# Altium project STM32F103_oled_demo.PrjPcb
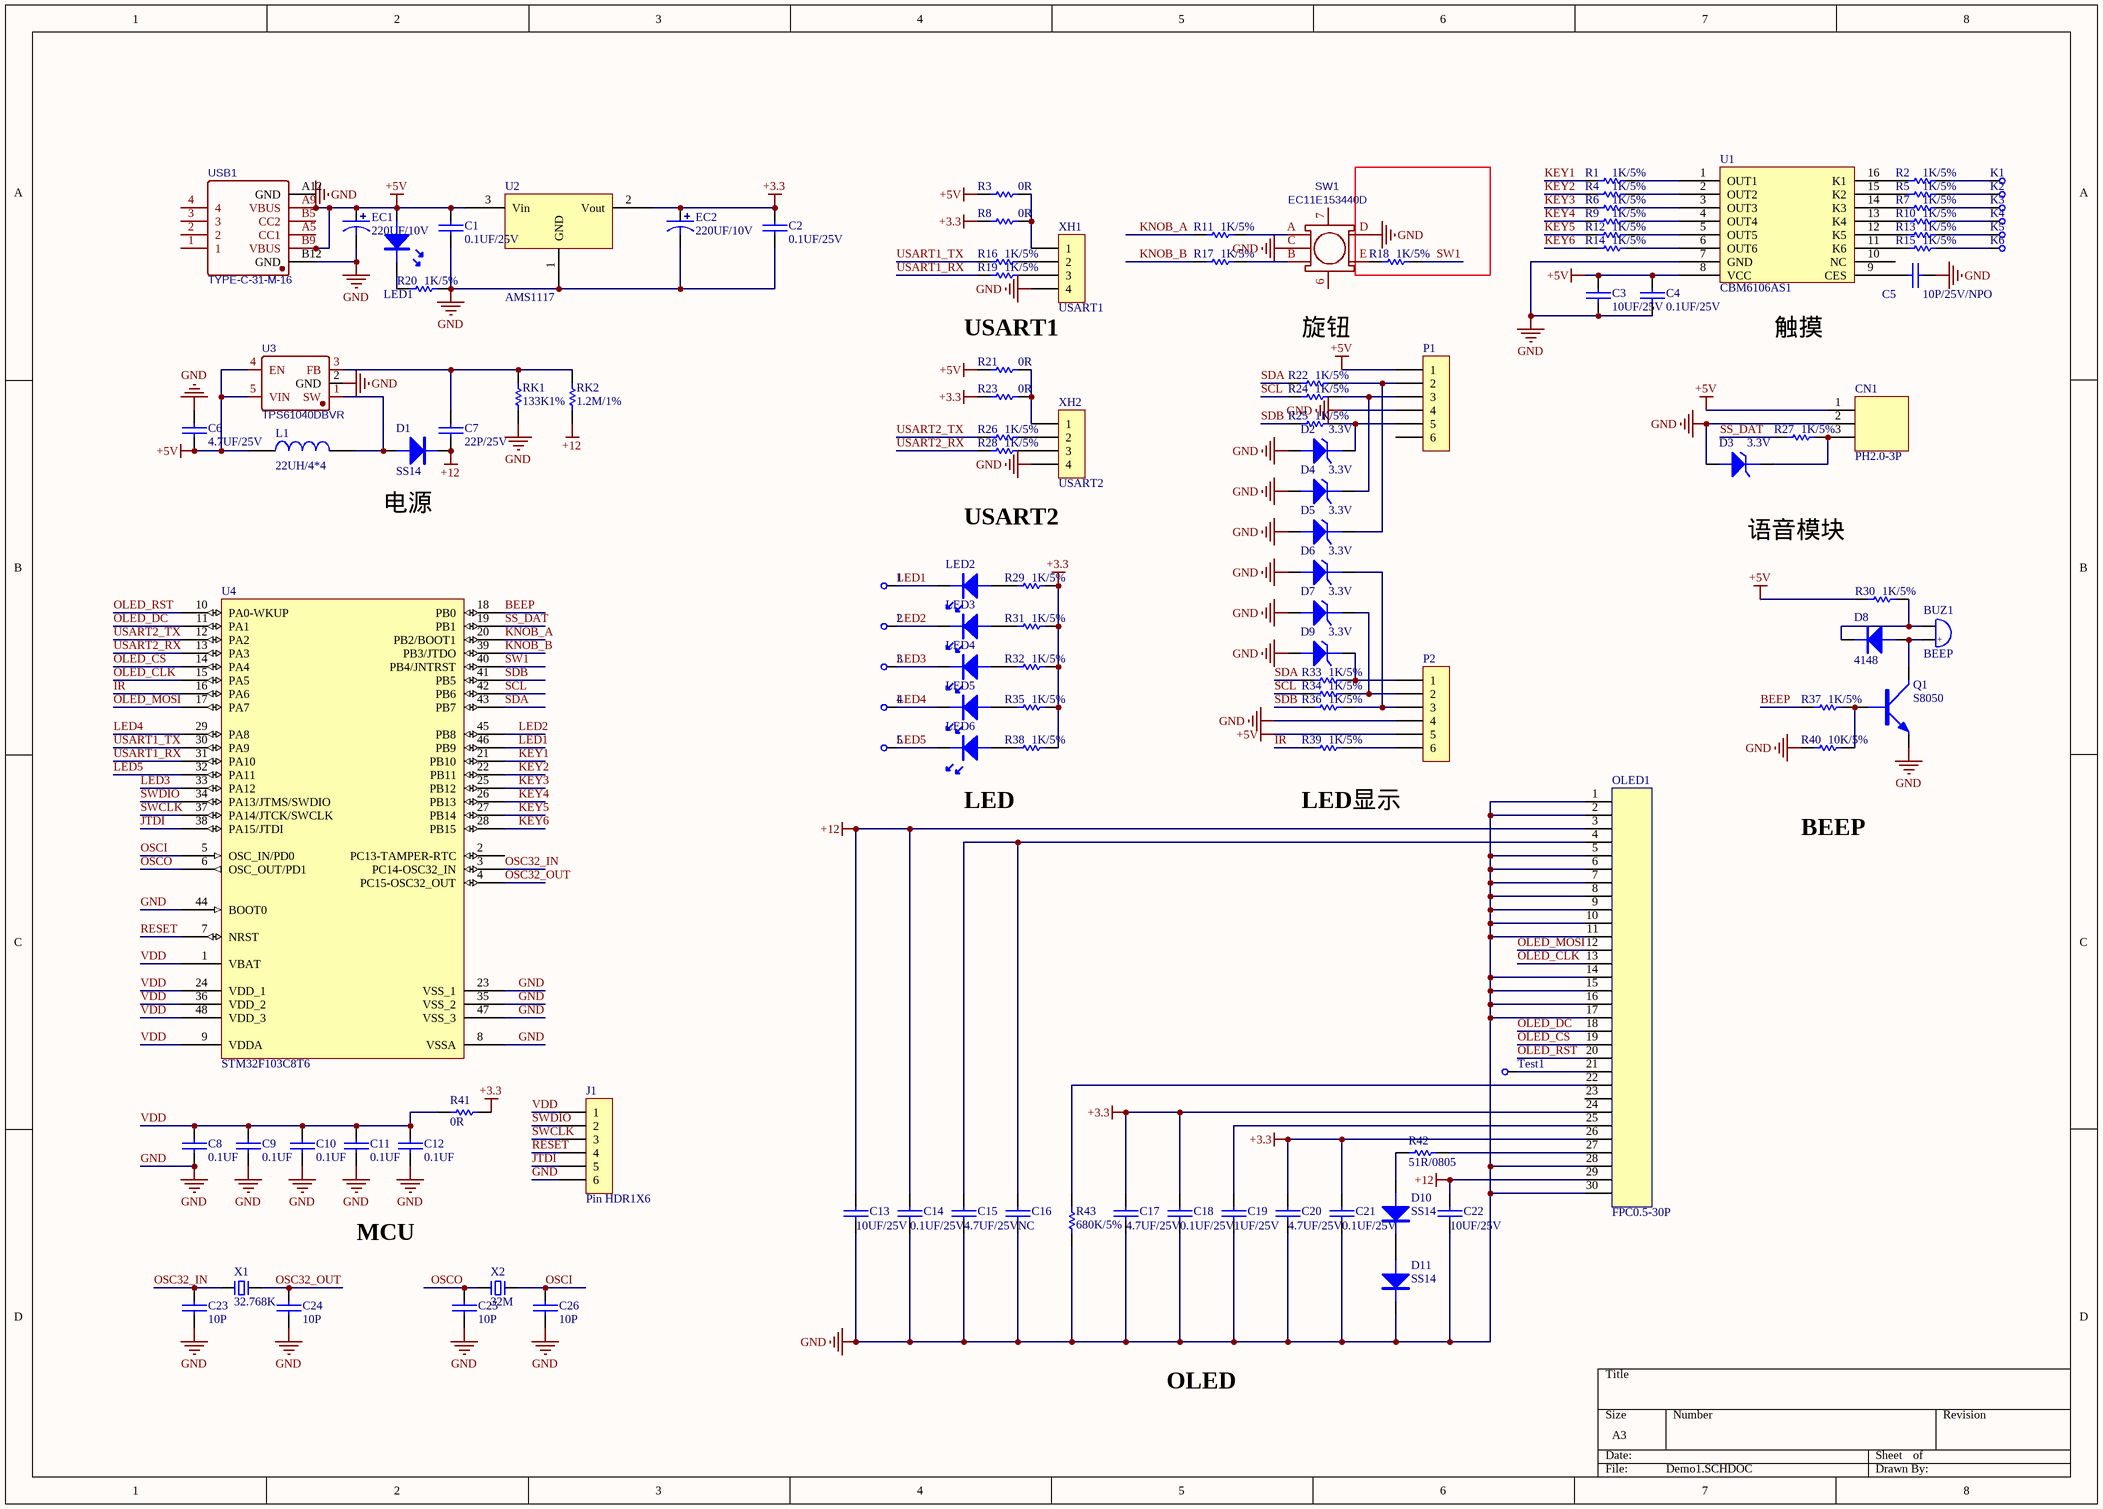
[diagram p0: Demo1.SCHDOC]
1 sheet, 120 parts. Net scope: global (net labels, ports and power ports of the same name join across sheets).
Board file: Demo1.PcbDoc

## Sheet Demo1.SCHDOC
size A3

### Parts
1  CHECK  [CHECK-A]  (value not drawn)
2  CHECK  [CHECK-A]  (value not drawn)
3  CHECK  [CHECK-A]  (value not drawn)
4  CHECK  [CHECK-A]  (value not drawn)
5  CHECK  [CHECK-A]  (value not drawn)
BUZ1  BEEP  [BEEP 6.5x12x6]
C1  0.1UF/25V  [0603C]
C2  0.1UF/25V  [0603C]
C3  10UF/25V  [0603C]
C4  0.1UF/25V  [0603C]
C5  10P/25V/NPO  [0603C]
C6  4.7UF/25V  [0603C]
C7  22P/25V  [0603C]
C8  0.1UF  [0603C]
C9  0.1UF  [0603C]
C10  0.1UF  [0603C]
C11  0.1UF  [0603C]
C12  0.1UF  [0603C]
C13  10UF/25V  [0603C]
C14  0.1UF/25V  [0603C]
C15  4.7UF/25V  [0603C]
C16  NC  [0603C]
C17  4.7UF/25V  [0603C]
C18  0.1UF/25V  [0603C]
C19  1UF/25V  [0603C]
C20  4.7UF/25V  [0603C]
C21  0.1UF/25V  [0603C]
C22  10UF/25V  [0603C]
C23  10P  [0603C]
C24  10P  [0603C]
C25  10P  [0603C]
C26  10P  [0603C]
CN1  PH2.0-3P  [PH2.0-3P]
D1  SS14  [SMA/DO-214AC]
D2  3.3V  [SOD-123]
D3  3.3V  [SOD-123]
D4  3.3V  [SOD-123]
D5  3.3V  [SOD-123]
D6  3.3V  [SOD-123]
D7  3.3V  [SOD-123]
D8  4148  [SOD-123]
D9  3.3V  [SOD-123]
D10  SS14  [SMA/DO-214AC]
D11  SS14  [SMA/DO-214AC]
EC1  220UF/10V  [SMD-EC6.3X6.3X10]
EC2  220UF/10V  [SMD-EC6.3X6.3X10]
J1  Pin HDR1X6  [Pin HDR1X6/2.54mm-S]
K1  CHECK  [CHECK-A]  (value not drawn)
K2  CHECK  [CHECK-A]  (value not drawn)
K3  CHECK  [CHECK-A]  (value not drawn)
K4  CHECK  [CHECK-A]  (value not drawn)
K5  CHECK  [CHECK-A]  (value not drawn)
K6  CHECK  [CHECK-A]  (value not drawn)
L1  22UH/4*4  [CD42]
LED1  (no value)  [LED-0603W]
LED2  (no value)  [LED-0603W]
LED3  (no value)  [LED-0603W]
LED4  (no value)  [LED-0603W]
LED5  (no value)  [LED-0603W]
LED6  (no value)  [LED-0603W]
OLED1  FPC0.5-30P  [FPC0.5-30P]
P1  (no value)  [Pin HDR1X6/2.54mm-S]
P2  (no value)  [Pin HDR1X6/2.54mm-S]
Q1  S8050  [SOT-23]
R1  1K/5%  [0603R]
R2  1K/5%  [0603R]
R3  0R  [0603R]
R4  1K/5%  [0603R]
R5  1K/5%  [0603R]
R6  1K/5%  [0603R]
R7  1K/5%  [0603R]
R8  0R  [0603R]
R9  1K/5%  [0603R]
R10  1K/5%  [0603R]
R11  1K/5%  [0603R]
R12  1K/5%  [0603R]
R13  1K/5%  [0603R]
R14  1K/5%  [0603R]
R15  1K/5%  [0603R]
R16  1K/5%  [0603R]
R17  1K/5%  [0603R]
R18  1K/5%  [0603R]
R19  1K/5%  [0603R]
R20  1K/5%  [0603R]
R21  0R  [0603R]
R22  1K/5%  [0603R]
R23  0R  [0603R]
R24  1K/5%  [0603R]
R25  1K/5%  [0603R]
R26  1K/5%  [0603R]
R27  1K/5%  [0603R]
R28  1K/5%  [0603R]
R29  1K/5%  [0603R]
R30  1K/5%  [0603R]
R31  1K/5%  [0603R]
R32  1K/5%  [0603R]
R33  1K/5%  [0603R]
R34  1K/5%  [0603R]
R35  1K/5%  [0603R]
R36  1K/5%  [0603R]
R37  1K/5%  [0603R]
R38  1K/5%  [0603R]
R39  1K/5%  [0603R]
R40  10K/5%  [0603R]
R41  0R  [0603R]
R42  51R/0805  [0805R]
R43  680K/5%  [0603R]
RK1  133K1%  [0603R]
RK2  1.2M/1%  [0603R]
SW1  EC11E153440D  [SW-TH_EC11XXXXXXXX]
Test1  CHECK  [CHECK-A]  (value not drawn)
U1  CBM6106AS1  [SOP16]
U2  AMS1117  [SOT223]
U3  TPS61040DBVR  [SOT-23-5_L3.0-W1.7-P0.95-LS2.8-BR]
U4  STM32F103C8T6  [LQFP48 7X7]
USB1  TYPE-C-31-M-16  [TYPE-C-SMD_TYPE-C-31-M-16]
X1  32.768K  [OSC 3215-2P]
X2  32M  [OSC HC-49SMD]
XH1  USART1  [XH4/2.54mm/180]
XH2  USART2  [XH4/2.54mm/180]

### Nets
+3.3: C2.2 C17.2 C18.2 C20.2 C21.2 EC2.1 OLED1.24 OLED1.26 R8.1 R23.1 R29.1 R31.1 R32.1 R35.1 R38.1 R41.2 U2.2(Vout)
+5V: C1.2 C3.2 C4.2 C6.1 CN1.1 EC1.1 L1.1 LED1.A P1.1 P2.5 R3.1 R21.1 R30.2 U1.8(VCC) U2.3(Vin) U3.4(EN) U3.5(VIN) USB1.A9(VBUS) USB1.B9(VBUS)
+12: C7.1 C13.2 C14.2 C22.2 D1.K OLED1.3 OLED1.29 RK2.1
GND: C1.1 C2.1 C3.1 C4.1 C5.1 C6.2 C8.1 C9.1 C10.1 C11.1 C12.1 C13.1 C14.1 C15.1 C16.1 C17.1 C18.1 C19.1 C20.1 C21.1 C22.1 C23.1 C24.1 C25.1 C26.1 CN1.2 D2.A D3.A D4.A D5.A D6.A D7.A D9.A D11.K EC1.2 EC2.2 J1.6 OLED1.1 OLED1.2 OLED1.5 OLED1.6 OLED1.7 OLED1.8 OLED1.9 OLED1.10 OLED1.11 OLED1.14 OLED1.15 OLED1.16 OLED1.17 OLED1.28 OLED1.30 P1.4 P2.4 Q1.E R20.1 R40.2 R43.1 RK1.1 SW1.C SW1.D U1.7(GND) U2.1(GND) U3.2(GND) U4.8(VSSA) U4.23(VSS_1) U4.35(VSS_2) U4.44(BOOT0) U4.47(VSS_3) USB1.B12(GND) XH1.4 XH2.4
BEEP: R37.2 U4.18(PB0)
IR: R39.2 U4.16(PA6)
JTDI: J1.5 U4.38(PA15/JTDI)
KEY1: R1.2 U4.21(PB10)
KEY2: R4.2 U4.22(PB11)
KEY3: R6.2 U4.25(PB12)
KEY4: R9.2 U4.26(PB13)
KEY5: R12.2 U4.27(PB14)
KEY6: R14.2 U4.28(PB15)
KNOB_A: R11.2 U4.20(PB2/BOOT1)
KNOB_B: R17.2 U4.39(PB3/JTDO)
LED1: 1.1 LED2.K U4.46(PB9)
LED2: 2.1 LED3.K U4.45(PB8)
LED3: 3.1 LED4.K U4.33(PA12)
LED4: 4.1 LED5.K U4.29(PA8)
LED5: 5.1 LED6.K U4.32(PA11)
OLED_CLK: OLED1.13 U4.15(PA5)
OLED_CS: OLED1.19 U4.14(PA4)
OLED_DC: OLED1.18 U4.11(PA1)
OLED_MOSI: OLED1.12 U4.17(PA7)
OLED_RST: OLED1.20 U4.10(PA0-WKUP)
OSC32_IN: C23.2 U4.3(PC14-OSC32_IN) X1.1
OSC32_OUT: C24.2 U4.4(PC15-OSC32_OUT) X1.2
OSCI: C26.2 U4.5(OSC_IN/PD0) X2.2
OSCO: C25.2 U4.6(OSC_OUT/PD1) X2.1
RESET: J1.4 U4.7(NRST)
SCL: R24.2 R34.2 U4.42(PB6)
SDA: R22.2 R33.2 U4.43(PB7)
SDB: R25.2 R36.2 U4.41(PB5)
SS_DAT: R27.2 U4.19(PB1)
SW1: R18.1 U4.40(PB4/JNTRST)
SWCLK: J1.3 U4.37(PA14/JTCK/SWCLK)
SWDIO: J1.2 U4.34(PA13/JTMS/SWDIO)
USART1_RX: R19.2 U4.31(PA10)
USART1_TX: R16.2 U4.30(PA9)
USART2_RX: R28.2 U4.13(PA3)
USART2_TX: R26.2 U4.12(PA2)
VDD: C8.2 C9.2 C10.2 C11.2 C12.2 J1.1 R41.1 U4.1(VBAT) U4.9(VDDA) U4.24(VDD_1) U4.36(VDD_2) U4.48(VDD_3)
NetBUZ1_1: BUZ1.1 D8.A Q1.C
NetBUZ1_2: BUZ1.2 D8.K R30.1
NetC5_2: C5.2 U1.9(CES)
NetC7_2: C7.2 RK1.2 RK2.2 U3.3(FB)
NetC15_2: C15.2 C16.2 OLED1.4
NetC19_2: C19.2 OLED1.25
NetCN1_3: CN1.3 D3.K R27.1
NetD1_A: D1.A L1.2 U3.1(SW)
NetD2_K: D2.K P1.5 R25.1
NetD4_K: D4.K P1.3 R24.1
NetD5_K: D5.K P1.2 R22.1
NetD6_K: D6.K P2.3 R36.1
NetD7_K: D7.K P2.2 R34.1
NetD9_K: D9.K P2.1 R33.1
NetD10_A: D10.A R42.1
NetD10_K: D10.K D11.A
NetK1_1: K1.1 R2.1
NetK2_1: K2.1 R5.1
NetK3_1: K3.1 R7.1
NetK4_1: K4.1 R10.1
NetK5_1: K5.1 R13.1
NetK6_1: K6.1 R15.1
NetLED1_K: LED1.K R20.2
NetLED2_A: LED2.A R29.2
NetLED3_A: LED3.A R31.2
NetLED4_A: LED4.A R32.2
NetLED5_A: LED5.A R35.2
NetLED6_A: LED6.A R38.2
NetOLED1_21: OLED1.21 Test1.1
NetOLED1_22: OLED1.22 R43.2
NetOLED1_27: OLED1.27 R42.2
NetP2_6: P2.6 R39.1
NetQ1_B: Q1.B R37.1 R40.1
NetR1_1: R1.1 U1.1(OUT1)
NetR2_2: R2.2 U1.16(K1)
NetR3_2: R3.2 R8.2 XH1.1
NetR4_1: R4.1 U1.2(OUT2)
NetR5_2: R5.2 U1.15(K2)
NetR6_1: R6.1 U1.3(OUT3)
NetR7_2: R7.2 U1.14(K3)
NetR9_1: R9.1 U1.4(OUT4)
NetR10_2: R10.2 U1.13(K4)
NetR11_1: R11.1 SW1.A
NetR12_1: R12.1 U1.5(OUT5)
NetR13_2: R13.2 U1.12(K5)
NetR14_1: R14.1 U1.6(OUT6)
NetR15_2: R15.2 U1.11(K6)
NetR16_1: R16.1 XH1.2
NetR17_1: R17.1 SW1.B
NetR18_2: R18.2 SW1.E
NetR19_1: R19.1 XH1.3
NetR21_2: R21.2 R23.2 XH2.1
NetR26_1: R26.1 XH2.2
NetR28_1: R28.1 XH2.3

Not connected (* = marked no-connect by the designer): OLED1 23; P1 6; SW1 6 7; U1 10(NC); U4 2(PC13-TAMPER-RTC); USB1 1 2 3 4 A5(CC1) A12(GND) B5(CC2)

### Notes on the sheet
- USART1
- 旋钮
- (near U1) 触摸
- (near D1) 电源
- USART2
- 语音模块
- LED
- (near R39) LED显示
- BEEP
- MCU
- OLED
- Labels drawn without touching a wire or pin: GND
- (in symbol BEEP) +

### Library data of the parts
1-5 K1-K6 Test1 = CHECK: 测试点
BUZ1 = BEEP: 蜂鸣器
C1-C26 = CAP: 无极性电容
D1 D8 D10 D11 = DIODE: 普通二极管
D2-D7 D9 = DIODE ZENER: 稳压二极管
EC1 EC2 = SMD_ECAP: 贴片电解电容
L1 = INDUCTOR
LED1-LED6 = LED
OLED1 = FPC0.5-30P: 贴片
P1 P2 = Pin HDR1X6
Q1 = NPN: NPN三极管
R1-R43 RK1 RK2 = RES
SW1 = EC11E153440D: BOM_Manufacturer: ALPS Electric; Contributor: LCSC; BOM_Supplier: LCSC; BOM_Supplier Part: C370992; BOM_Manufacturer Part: EC11E153440D; spicePre: S; spiceSymbolName: EC11E153440D
U2 = AMS1117: 三端稳压芯片
U3 = TPS61040DBVR: BOM_Manufacturer: TI; SMT Type: Basic; BOM_Supplier: LCSC; BOM_Manufacturer Part: TPS61040DBVR; BOM_LCSC Assembly: Yes; image: //image.lceda.cn/szlcsc/C7722.jpg; BOM_Supplier Part: C7722; spicePre: U; spiceSymbolName: TPS61040DBVR
USB1 = TYPE-C-31-M-16: BOM_Manufacturer: Korean Hroparts Elec; Contributor: LCSC; BOM_Supplier: LCSC; BOM_Supplier Part: C283541; BOM_Manufacturer Part: TYPE-C-31-M-16; spicePre: U; spiceSymbolName: TYPE-C-31-M-16
X1 X2 = XTAL-2P: 2脚无源脚晶振
XH1 XH2 = XH4